# EAGLE design sx-HX711 V 1.0 (EAGLE 7.6.0)
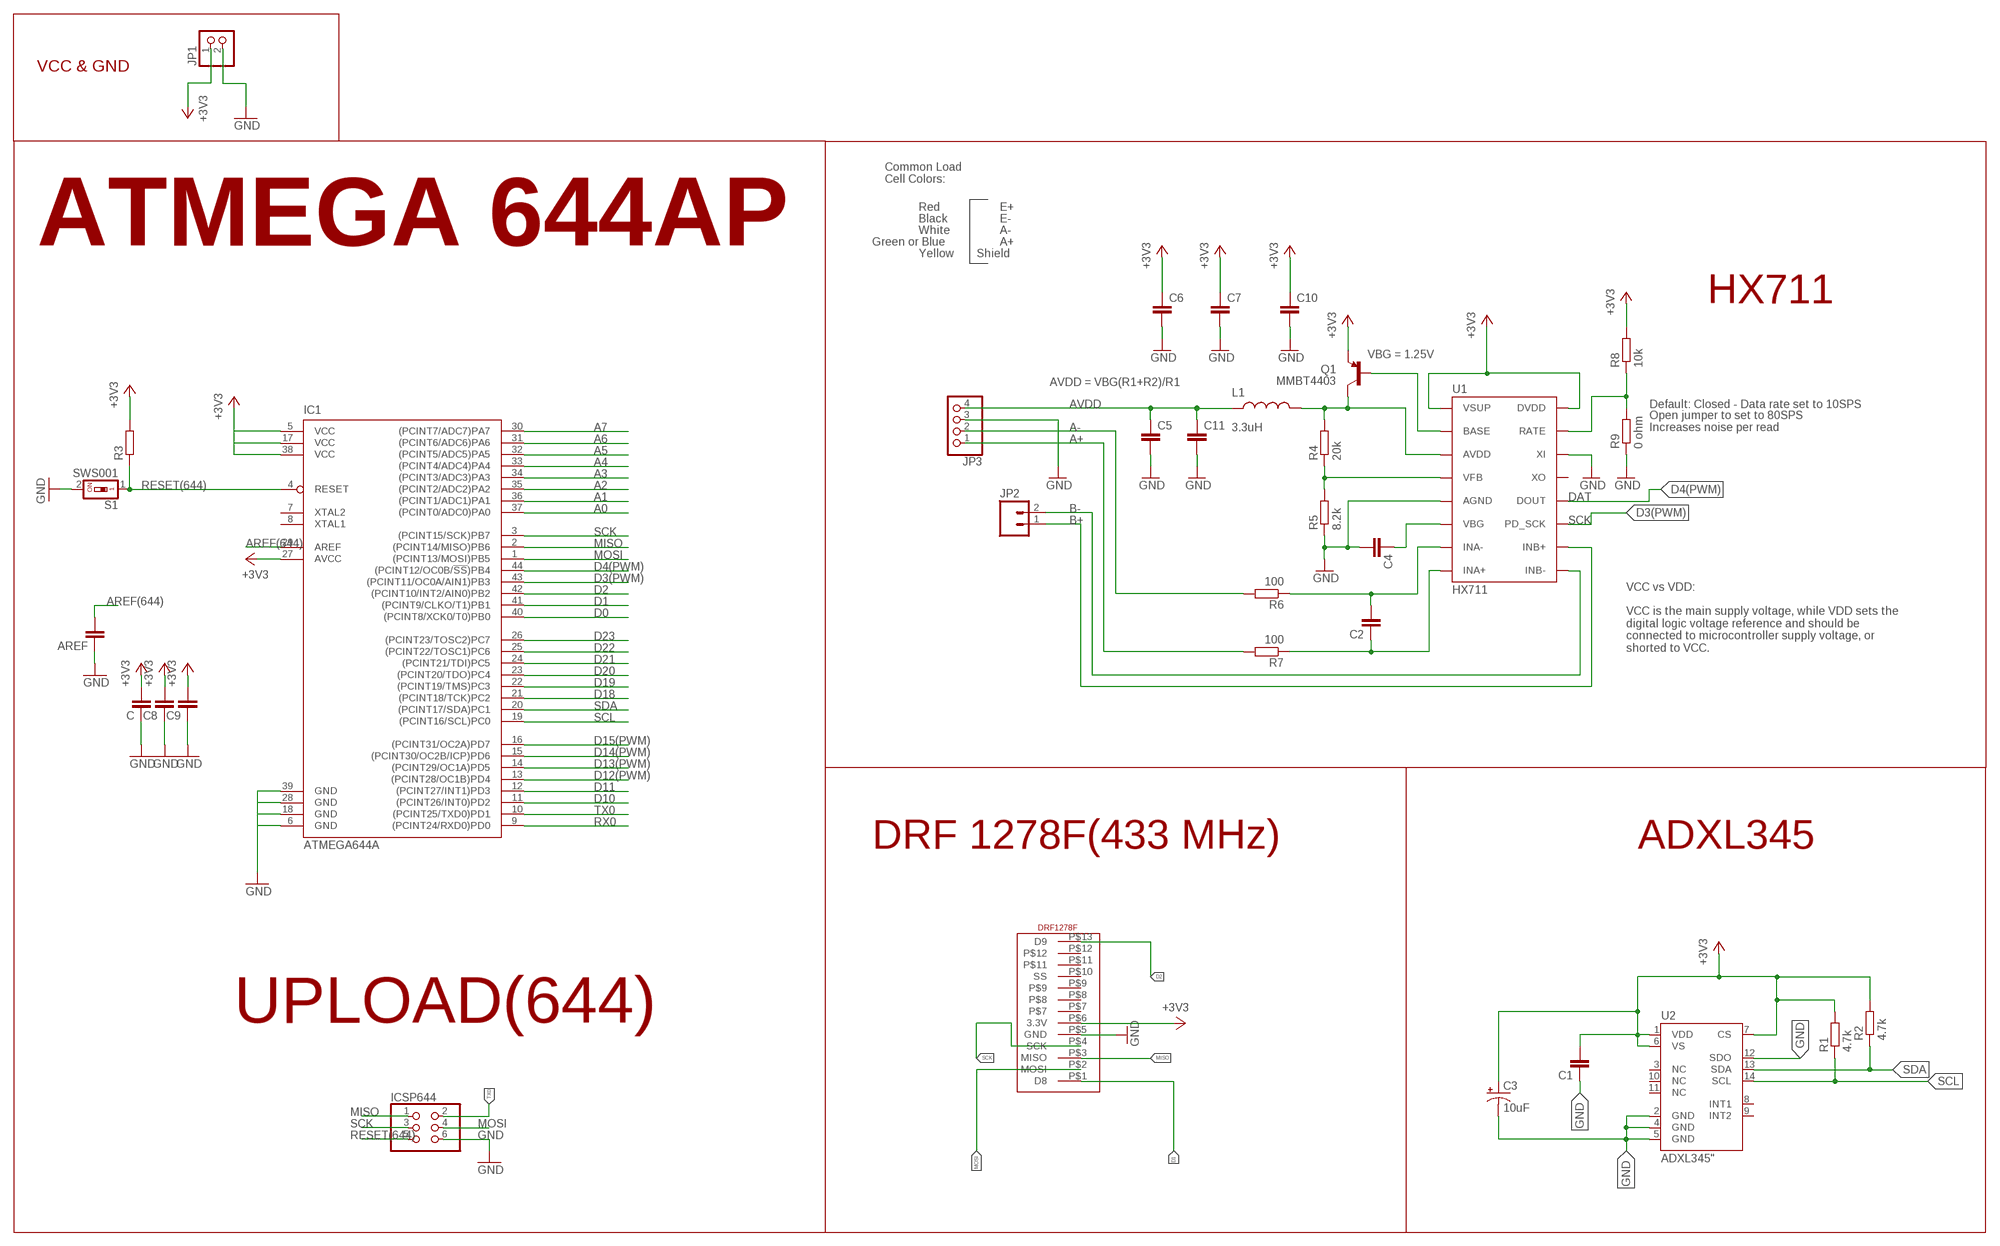
[diagram p0: schematic, sheet 1]

## Parts
AREF  100nF  C-EUC0805  [C0805]
C  22 uF  C-EUC0805  [C0805]
C1  0.1uF  C-EUC0805  [C0805]
C2  0.1uF  C-EUC0805  [C0805]
C3  10uF  CAP_POL1206  [EIA3216]
C4  0.1uF  C-EUC0805  [C0805]
C5  0.1uF  C-EUC0805  [C0805]
C6  0.1uF  C-EUC0805  [C0805]
C7  0.1uF  C-EUC0805  [C0805]
C8  100nF  C-EUC0805  [C0805]
C9  100nF  C-EUC0805  [C0805]
C10  10uF  C-EUC0805  [C0805]
C11  10uF  C-EUC0805  [C0805]
IC1  ATMEGA644A  [TQFP44]
ICSP644  PINHD-2X3  [2X03]
JP1  PINHD-1X2  [1X02]
JP2  M02PTH  [1X02]
JP3  PINHD-1X4  [1X04]
L1  3.3uH  INDUCTOR0805-IND  [0805]
Q1  MMBT4403  TRANSISTOR_PNPMMBT4403  [SOT23-3]
R1  4.7k  R-EU_R0805  [R0805]
R2  4.7k  R-EU_R0805  [R0805]
R3  R-EU_R0805  [R0805]
R4  20k  R-EU_R0805  [R0805]
R5  8.2k  R-EU_R0805  [R0805]
R6  100  R-EU_R0805  [R0805]
R7  100  R-EU_R0805  [R0805]
R8  10k  R-EU_R0805  [R0805]
R9  0 ohm  R-EU_R0805  [R0805]
S1  SWS001  [SMS-001]
U1  HX711  HX711HX711  [SO16]
U2  ADXL345"  [ADXL3451:1]
U$1  DRF1278F  [DIP13]

## Nets
+3V3: C1.2 C3.A(+) C6.1 C7.1 C8.2 C9.2 C10.1 C.2 IC1.5(VCC) IC1.17(VCC) IC1.27(AVCC) IC1.38(VCC) JP1.1 Q1.2(E) R1.2 R2.2 R3.2 R8.2 U1.1(VSUP) U1.16(DVDD) U2.1(VDD) U2.6(VS) U2.7(CS) U$1.P$6(3.3V)
A0: IC1.37((PCINT0/ADC0)PA0)
A1: IC1.36((PCINT1/ADC1)PA1)
A2: IC1.35((PCINT2/ADC2)PA2)
A3: IC1.34((PCINT3/ADC3)PA3)
A4: IC1.33((PCINT4/ADC4)PA4)
A5: IC1.32((PCINT5/ADC5)PA5)
A6: IC1.31((PCINT6/ADC6)PA6)
A7: IC1.30((PCINT7/ADC7)PA7)
A+: JP3.1 R7.2
A-: JP3.2 R6.2
AREF(644): AREF.2 IC1.29(AREF)
AVDD: C5.1 C11.1 JP3.4 L1.1
B+: JP2.1 U1.10(INB+)
B-: JP2.2 U1.9(INB-)
D0: IC1.40((PCINT8/XCK0/T0)PB0)
D1: IC1.41((PCINT9/CLKO/T1)PB1) U$1.P$1(D8)
D2: IC1.42((PCINT10/INT2/AIN0)PB2) U$1.P$13(D9)
D3(PWM): IC1.43((PCINT11/OC0A/AIN1)PB3) U1.11(PD_SCK)
D4(PWM): IC1.44((PCINT12/OC0B/!SS!)PB4) U1.12(DOUT)
D10: IC1.11((PCINT26/INT0)PD2)
D11: IC1.12((PCINT27/INT1)PD3)
D12(PWM): IC1.13((PCINT28/OC1B)PD4)
D13(PWM): IC1.14((PCINT29/OC1A)PD5)
D14(PWM): IC1.15((PCINT30/OC2B/ICP)PD6)
D15(PWM): IC1.16((PCINT31/OC2A)PD7)
D18: IC1.21((PCINT18/TCK)PC2)
D19: IC1.22((PCINT19/TMS)PC3)
D20: IC1.23((PCINT20/TDO)PC4)
D21: IC1.24((PCINT21/TDI)PC5)
D22: IC1.25((PCINT22/TOSC1)PC6)
D23: IC1.26((PCINT23/TOSC2)PC7)
GND: AREF.1 C1.1 C3.C(-) C4.2 C5.2 C6.2 C7.2 C8.1 C9.1 C10.2 C11.2 C.1 IC1.6(GND) IC1.18(GND) IC1.28(GND) IC1.39(GND) ICSP644.6 JP1.2 JP3.3 R5.1 R9.1 S1.2 U1.5(AGND) U1.14(XI) U2.2(GND) U2.4(GND) U2.5(GND) U2.12(SDO) U$1.P$5(GND)
MISO: IC1.2((PCINT14/MISO)PB6) ICSP644.1 U$1.P$3(MISO)
MOSI: IC1.1((PCINT13/MOSI)PB5) ICSP644.4 U$1.P$2(MOSI)
N$3: R4.1 R5.2 U1.4(VFB)
N$4: Q1.1(B) U1.2(BASE)
N$5: L1.2 Q1.3(C) R4.2 U1.3(AVDD)
N$7: C4.1 U1.6(VBG)
N$8: R8.1 R9.2 U1.15(RATE)
N$9: C2.2 R6.1 U1.7(INA-)
N$10: C2.1 R7.1 U1.8(INA+)
RESET(644): IC1.4(RESET) ICSP644.5 R3.1 S1.1
RX0: IC1.9((PCINT24/RXD0)PD0)
SCK: IC1.3((PCINT15/SCK)PB7) ICSP644.3 U$1.P$4(SCK)
SCL: IC1.19((PCINT16/SCL)PC0) R1.1 U2.14(SCL)
SDA: IC1.20((PCINT17/SDA)PC1) R2.1 U2.13(SDA)
TX0: IC1.10((PCINT25/TXD0)PD1) ICSP644.2
Unconnected: IC1.7(XTAL2) IC1.8(XTAL1) U1.13(XO) U2.3(NC) U2.8(INT1) U2.9(INT2) U2.10(NC) U2.11(NC) U$1.P$7 U$1.P$8 U$1.P$9 U$1.P$10(SS) U$1.P$11 U$1.P$12

## Notes on the sheet
- VCC & GND
- Common Load
  Cell Colors:
- Red | E+
- Black | E-
- White | A-
- ATMEGA 644AP | Green or Blue | A+
- Yellow | Shield
- HX711
- VBG = 1.25V
- AVDD = VBG(R1+R2)/R1
- Default: Closed - Data rate set to 10SPS
- Open jumper to set to 80SPS
  Increases noise per read
- DAT
- SCK
- VCC vs VDD:
  
  VCC is the main supply voltage, while VDD sets the
  digital logic voltage reference and should be
  connected to microcontroller supply voltage, or
  shorted to VCC.
- DRF 1278F(433 MHz) | ADXL345
- UPLOAD(644)

## Library data of the parts
AREF C C1 C2 C4-C11 = rcl:C-EU: CAPACITOR, European symbol
C3 = SparkFun:CAP_POL: Capacitor Polarized These are standard SMD and PTH capacitors. Normally 10uF, 47uF, and 100uF in electrolytic and tantalum varieties. Always verify the external diameter of the through hole cap, it varies with capacity, voltage, and manufacturer. The EIA devices should be standard.
IC1 = atmel:ATMEGA644: 8-bit Microcontroller with 64K Bytes In-System Programmable Flash Source: http://www.atmel.com/dyn/resources/prod_documents/doc2593.pdf; MPN: ATMEGA644PV-10AU; OC_FARNELL: 1455123; OC_NEWARK: 58M3748
ICSP644 = pinhead:PINHD-2X3: PIN HEADER
JP1 = pinhead:PINHD-1X2: PIN HEADER
JP2 = SparkFun-Connectors:M02: Standard 2-pin 0.1" header. Use with - straight break away headers ( PRT-00116) - right angle break away headers (PRT-00553) - swiss pins (PRT-00743) - machine pins (PRT-00117) - female headers (PRT-00115) Molex polarized connector foot print use with: PRT-08233 with associated crimp pins and housings. 2.54_SCREWTERM for use with PRT-10571. 3.5mm Screw Terminal footprints for PRT-08084 5mm Screw Terminal footprints for use with PRT-08432
JP3 = pinhead:PINHD-1X4: PIN HEADER
L1 = SparkFun-Passives:INDUCTOR: Inductors Basic Inductor/Choke - 0603 and 1206. Footprints are not proven and vary greatly between part numbers. INDUCTOR POWER 3.3UH 4.0A SMD 0.197" L x 0.197" W x 0.177" H (5.00mm x 5.00mm x 4.50mm); PROD_ID: NDUC-13076
Q1 = SparkFun-DiscreteSemi:TRANSISTOR_PNP: Generic PNP BJT Double check pinouts against datasheets- not all devices are the same! MMBT3906 - 40V 200mA SOT-23 (TRANS-08052) MMBT4403 - 40V 600mA SOT-23 (TRANS-09245); PROD_ID: TRANS-09245
R1-R9 = resistor:R-EU_: RESISTOR, European symbol
S1 = smd-special:SWS001: SMD Dip Switch 1 pol.
U1 = Testing:HX711; PROD_ID: IC-12445
U2 = SparkFun-Sensors:ADXL345: 3-axis SPI/I2C 2/4/8/16g accelerometer; PROD_ID: IC-09097
U$1 = small_header:DRF1278F

## Board
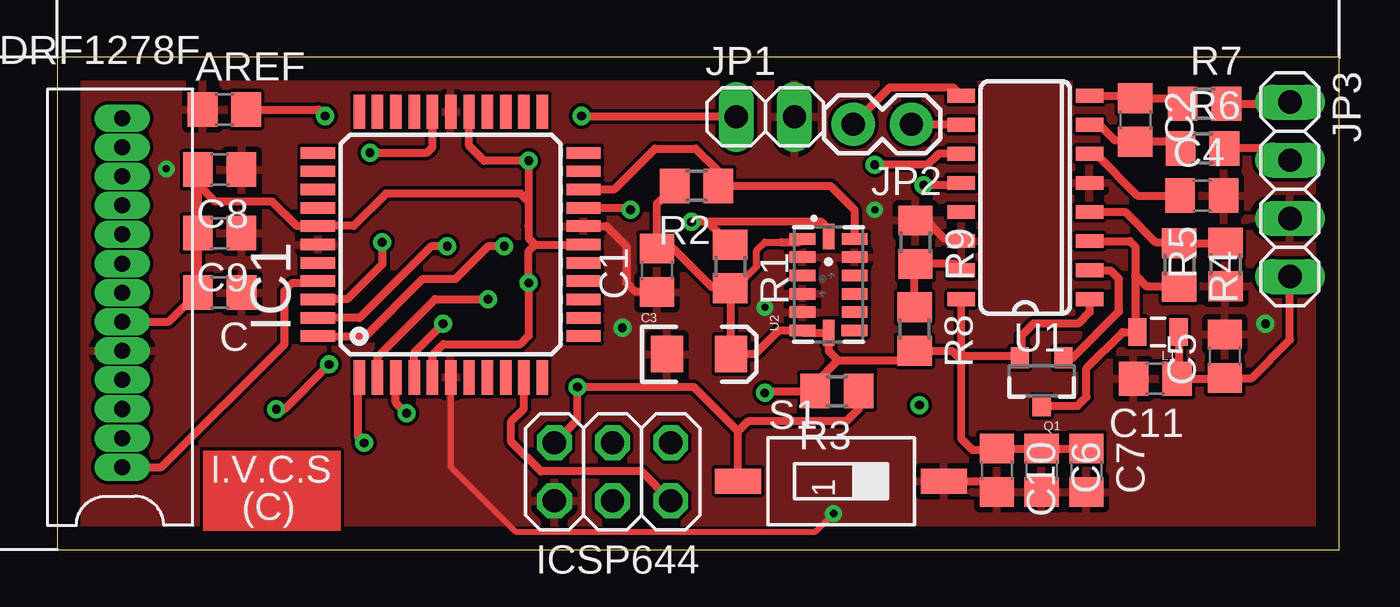
[diagram p1: board, top side]
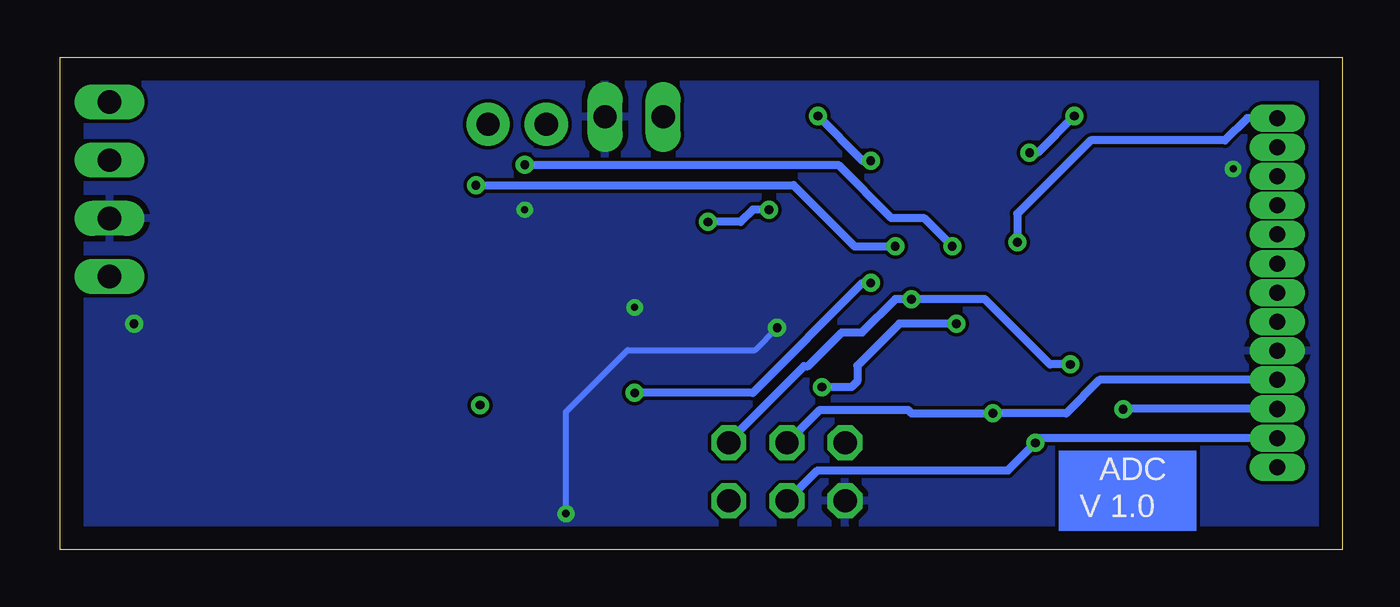
[diagram p2: board, bottom side, seen from below]

Size 56 x 21.5 mm. Coordinates in mm from the lower left corner, seen from the top.
Outline: 0,0 56,0 56,21.5 0,21.5 0,0
Copper layers (1*16): Top 0.035mm / dielectric 1.5mm / Bottom 0.035mm
Design rules "default *": minimum track width 10mil, minimum drill 11mil, track to track 6mil, track to pad 6mil, pad to pad 6mil, via to via 6mil, smd to smd 6mil, copper to edge 40mil, drill to drill 8mil, minimum pad ring 10mil, minimum via ring 8mil, stop-mask expansion 4mil, vias tented up to drill 0mil, thermal gap 10mil

### Footprints (pad centres in the part's own frame; a part is rotated, then mirrored left to right if it is on the bottom)
C0805 = smd 1.3 x 1.5: 1 -0.95,0; 2 0.95,0
EIA3216 = smd 1.4 x 1.6: A 1.4,0; C -1.4,0
TQFP44 = smd 1.5 x 0.5: 1 -5.8,4; 2 -5.8,3.2; 3 -5.8,2.4; 4 -5.8,1.6; 5 -5.8,0.8; 6 -5.8,0; 7 -5.8,-0.8; 8 -5.8,-1.6; 9 -5.8,-2.4; 10 -5.8,-3.2; 11 -5.8,-4; 23 5.8,-4; 24 5.8,-3.2; 25 5.8,-2.4; 26 5.8,-1.6; 27 5.8,-0.8; 28 5.8,0; 29 5.8,0.8; 30 5.8,1.6; 31 5.8,2.4; 32 5.8,3.2; 33 5.8,4 | smd 0.5 x 1.5: 12 -4,-5.8; 13 -3.2,-5.8; 14 -2.4,-5.8; 15 -1.6,-5.8; 16 -0.8,-5.8; 17 0,-5.8; 18 0.8,-5.8; 19 1.6,-5.8; 20 2.4,-5.8; 21 3.2,-5.8; 22 4,-5.8; 34 4,5.8; 35 3.2,5.8; 36 2.4,5.8; 37 1.6,5.8; 38 0.8,5.8; 39 0,5.8; 40 -0.8,5.8; 41 -1.6,5.8; 42 -2.4,5.8; 43 -3.2,5.8; 44 -4,5.8
2X03 = drill 1.016 octagon: 1 -2.54,-1.27; 2 -2.54,1.27; 3 0,-1.27; 4 0,1.27; 5 2.54,-1.27; 6 2.54,1.27
1X02 = drill 1.016 long: 1 -1.27,0; 2 1.27,0
1X02' = drill 1.016 pad 1.88: 1 0,0; 2 2.54,0
1X04 = drill 1.016 long: 1 -3.81,0; 2 -1.27,0; 3 1.27,0; 4 3.81,0
0805 = smd 0.8 x 1.2: 1 -0.9,0; 2 0.9,0
SOT23-3 = smd 0.8 x 0.9: 1 -0.95,-1; 2 0.95,-1; 3 0,1.1
R0805 = smd 1.3 x 1.5: 1 -0.95,0; 2 0.95,0
SMS-001 = smd 1.092 x 2.007: 1 0,-4.496; 2 0,4.496
SO16 = smd 0.6 x 1.2: 1 -4.445,-2.8; 2 -3.175,-2.8; 3 -1.905,-2.8; 4 -0.635,-2.8; 5 0.635,-2.8; 6 1.905,-2.8; 7 3.175,-2.8; 8 4.445,-2.8; 9 4.445,2.8; 10 3.175,2.8; 11 1.905,2.8; 12 0.635,2.8; 13 -0.635,2.8; 14 -1.905,2.8; 15 -3.175,2.8; 16 -4.445,2.8
ADXL3451:1 = smd 0.5 x 1.124: 1 2,1.138; 2 1.2,1.138; 3 0.4,1.138; 4 -0.4,1.138; 5 -1.2,1.138; 6 -2,1.138; 8 -2,-1.13; 9 -1.2,-1.138; 10 -0.4,-1.138; 11 0.4,-1.138; 12 1.2,-1.138; 13 2,-1.138 | smd 1.124 x 0.5: 7 -2.1,0; 14 2.1,0
DIP13 = drill 0.7 long: P$1 -2,0; P$2 -2,-1.27; P$3 -2,-2.54; P$4 -2,-3.81; P$5 -2,-5.08; P$6 -2,-6.35; P$7 -2,-7.62; P$8 -2,-8.89; P$9 -2,-10.16; P$10 -2,-11.43; P$11 -2,-12.7; P$12 -2,-13.97; P$13 -2,-15.24

### Placement (x,y rotation side)
AREF  7.3,19.22 0 top
C  7.1,11.23 180 top
C1  26.19,12.2 90 top
C2  47.08,18.76 270 top
C3  28.03,8.54 0 top
C4  49.99,15.46 0 top
C5  51,8.45 90 top
C6  42.99,3.47 270 top
C7  44.95,3.47 270 top
C8  7.1,16.6 180 top
C9  7.1,13.82 180 top
C10  41.04,3.47 270 top
C11  47.96,7.46 180 top
IC1  17.19,13.32 90 top
ICSP644  24.26,3.4 180 top
JP1  30.93,18.9 0 top
JP2  [1X02']  37.3,18.58 180 top
JP3  53.84,15.74 270 top
L1  48.08,9.5 180 top
Q1  42.99,7.38 180 top
R1  29.4,12.37 270 top
R2  27.92,15.88 180 top
R3  34.06,6.93 180 top
R4  49.01,12.43 270 top
R5  51.03,12.46 90 top
R6  50.02,17.52 0 top
R7  50.11,19.47 0 top
R8  37.44,9.63 270 top
R9  37.48,13.42 270 top
S1  34.23,2.99 270 top
U1  42.28,15.38 90 top
U2  33.69,11.57 90 top
U$1  0.84,3.6 180 top

### Tracks (layer width: path | path; a pad name or v marks a point on that pad's centre or on a via)
+3V3  (via drill 0.38)
  Top 0.305: R1.2 29.61,11.42 30.55,12.36 30.55,13.07 30.9,13.42 31.61,13.42
  Top 0.356: IC1.27 17.99,17.63 18.64,16.98 v20.59,16.98 20.59,15.2 | 20.59,15.2 20.59,14.13 | 20.59,14.13 20.59,13.6 20.87,13.32 | 20.87,13.32 IC1.17 | 20.58,14.12 20.59,14.13 | U$1.P$6 4.88,9.95 C.2 C9.2 C8.2 6.15,15.96 6.9,15.2 9.39,15.2 10.47,14.12 IC1.38 11.4,14.13 12.95,14.13 14.36,15.55 20.25,15.55 20.59,15.2 | v30.9,6.84 30.98,6.93 R3.2 33.11,7.27 34.1,8.27 | C7.1 C6.1 C10.1 40.98,4.36 39.97,4.36 39.48,4.84 39.48,8.27 | U1.1 45.08,10.36 44.59,9.87 42.64,9.87 42.1,9.33 42.1,8.44 Q1.2 41.98,8.45 39.66,8.45 39.48,8.27 | 34.1,8.27 36.67,8.27 R8.2 39.07,8.68 39.48,8.27 | 39.48,8.27 U1.16 | IC1.5 16.39,8.51 16.86,8.98 20.24,8.98 20.59,9.33 v20.59,11.65 20.59,13.05 20.87,13.32 | JP1.1 22.94,18.9 v22.9,18.94 | R2.2 26.19,15.11 C1.2 26.91,13.15 28.59,11.47 29.34,11.47 R1.2 29.43,11.38 C3.A 30.47,8.54 31.49,9.57 U2.6 32.65,9.47 U2.7 33.69,8.68 34.1,8.27 | 31.61,13.42 32.4,13.42 U2.1
  Bottom 0.356: v20.59,11.65 20.95,11.65 25.75,6.84 v30.9,6.84 | v20.59,16.98 20.95,16.98 v22.9,18.94
A+
  Top 0.356: R7.2 53.76,19.47 JP3.1
A-
  Top 0.356: JP3.2 53.32,17.52 R6.2
AREF(644)  (via drill 0.38)
  Top 0.356: AREF.2 11.42,19.22 v11.7,18.94 | v13.66,17.34 16.15,17.34 16.39,17.58 IC1.29
  Bottom 0.356: v11.7,18.94 13.3,17.34 v13.66,17.34
AVDD
  Top 0.356: L1.1 48.98,7.53 C11.1 50.96,7.46 C5.1 52.18,7.5 53.84,9.16 JP3.4
B+
  Top 0.356: 39.06,18.55 U1.10 39.46,18.58 JP2.1
B-
  Top 0.356: JP2.2 36.37,20.18 39.13,20.18 U1.9
D1
  Top 0.356: U$1.P$1 4.55,3.6 9.92,8.98 9.92,11.29 10.28,11.65 11.31,11.65 IC1.41
D2  (via drill 0.38)
  Top 0.356: v14.19,13.42 14.19,12.46 12.67,10.94 11.4,10.94 IC1.42
  Bottom 0.356: U$1.P$13 4.15,18.84 5.12,17.87 10.99,17.87 14.19,14.67 v14.19,13.42
D3(PWM)  (via drill 0.38)
  Top 0.356: U1.11 38.5,17.29 38.02,16.8 v35.7,16.8 | v17.04,13.25 16.32,13.25 13.2,10.12 IC1.43
  Bottom 0.356: v35.7,16.8 22.01,16.8 19.7,14.49 18.28,14.49 v17.04,13.25
D4(PWM)  (via drill 0.38)
  Top 0.356: U1.12 39.38,15.91 v37.84,15.91 | v19.52,13.25 18.81,13.25 17.39,11.82 15.97,11.82 13.47,9.32 IC1.44
  Bottom 0.356: v37.84,15.91 23.97,15.91 21.3,13.25 v19.52,13.25
GND  (via drill 0.3, 0.33, 0.38)
  Top 0.254: IC1.6 17.19,3.61 20.02,0.79 33.12,0.79 v33.91,1.57
  Top 0.356: R9.1 37.95,14.37 38.73,13.6 39.36,13.6 U1.14 | IC1.18 23.98,14.12 24.86,13.25 24.86,11.65 25.21,11.29 26.15,11.29 C1.1 | S1.2 40.56,2.99 C10.2
  Bottom 0.254: v33.91,1.57 33.91,6.02 31.22,8.71 25.66,8.71 v24.68,9.69
  other vias: 35.7,14.85 30.9,10.58 4.77,16.62 52.77,9.87
  pour Top: 0.28,21.31 0.03,0.21 55.89,0.21 55.74,21.16
  pour Bottom: 0.23,21.31 55.74,21.16 55.94,0.18 0.18,0.18
MISO  (via drill 0.38)
  Top 0.356: v9.57,6.13 9.92,6.13 v11.88,8.09 | IC1.2 13.99,8.42 16.5,10.94 v18.81,10.94
  Bottom 0.356: U$1.P$3 9.56,6.14 v9.57,6.13 | v11.88,8.09 12.77,8.09 15.61,10.94 v18.81,10.94 19.52,10.94 20.97,9.49 21.86,9.49 23.34,8.01 23.51,8.01 26.8,4.73 ICSP644.1
MOSI  (via drill 0.38)
  Top 0.356: IC1.1 13.12,7.46 13.12,4.94 v13.4,4.66
  Bottom 0.356: ICSP644.4 22.92,3.47 14.6,3.47 v13.4,4.66 13.19,4.87 U$1.P$2
N$3
  Top 0.356: U1.4 46.65,14.74 47.97,13.42 48.97,13.42 R4.1 51.01,13.38 R5.2
N$4
  Top 0.356: U1.2 45.11,12.18 46.02,12.18 46.37,11.82 46.37,10.4 44.35,8.38 Q1.1
N$5
  Top 0.356: U1.3 46.85,13.47 47.08,13.25 47.08,12 | 47.08,12 47.08,9.6 L1.2 46.54,9.5 44.95,7.91 44.95,6.67 44.56,6.28 Q1.3 | R4.2 47.6,11.48 47.08,12
N$7
  Top 0.356: U1.6 45.36,17.29 47.18,15.46 C4.1
N$8
  Top 0.356: 37.09,12.43 R9.2 | R8.1 37.44,12.43 R9.2 | U1.15 39.21,12.47 R9.2
N$9
  Top 0.356: U1.7 45.51,18.55 46.2,17.87 47.02,17.87 C2.2 48.78,17.81 R6.1
N$10
  Top 0.356: U1.8 46.97,19.82 C2.1 48.92,19.71 R7.1
N$11  (via drill 0.38)
  other vias: 37.66,6.31
RESET(644)  (via drill 0.38)
  Top 0.356: S1.1 29.74,5.17 | 29.74,5.17 27.8,7.1 v22.73,7.1 22.73,5.68 ICSP644.5 | 15.61,7.55 IC1.4 15.59,8.6 v16.86,9.87 | R3.1 35.01,6.15 34.46,5.6 30.17,5.6 29.74,5.17
  Bottom 0.356: v16.86,9.87 19.35,9.87 21.18,8.04 21.18,7.35 21.43,7.1 v22.73,7.1
SCK  (via drill 0.38)
  Top 0.356: v15.26,5.96 14.79,6.42 IC1.3
  Bottom 0.356: U$1.P$4 10.6,7.41 12.06,5.96 v15.26,5.96 18.81,5.96 18.97,6.11 22.82,6.11 ICSP644.3
SCL  (via drill 0.38)
  Top 0.356: R1.1 28.4,14.31 | 28.4,14.31 v27.7,14.31 | U2.14 33.69,14.02 33.39,14.31 28.4,14.31 | IC1.19 24.96,14.92 v25.04,14.85
  Bottom 0.356: v25.04,14.85 25.75,14.85 26.28,14.31 v27.7,14.31
SDA
  Top 0.356: U2.13 34.81,13.58 34.81,14.85 33.78,15.88 R2.1 28.87,16.52 27.88,17.51 26.1,17.51 24.31,15.72 IC1.20
TX0
  Top 0.356: ICSP644.2 25.51,3.42 21.12,3.42 19.83,4.71 19.83,5.6 20.39,6.16 IC1.10
(copper drawn outside any net)
  shapes: Bottom area x1, Top area x1

### Text on the board
tPlace: I.V.C.S | (C)
bPlace: ADC | V 1.0